# Altium schematic sheet JTAG&Trace.SchDoc
size A4; Revision: B.2
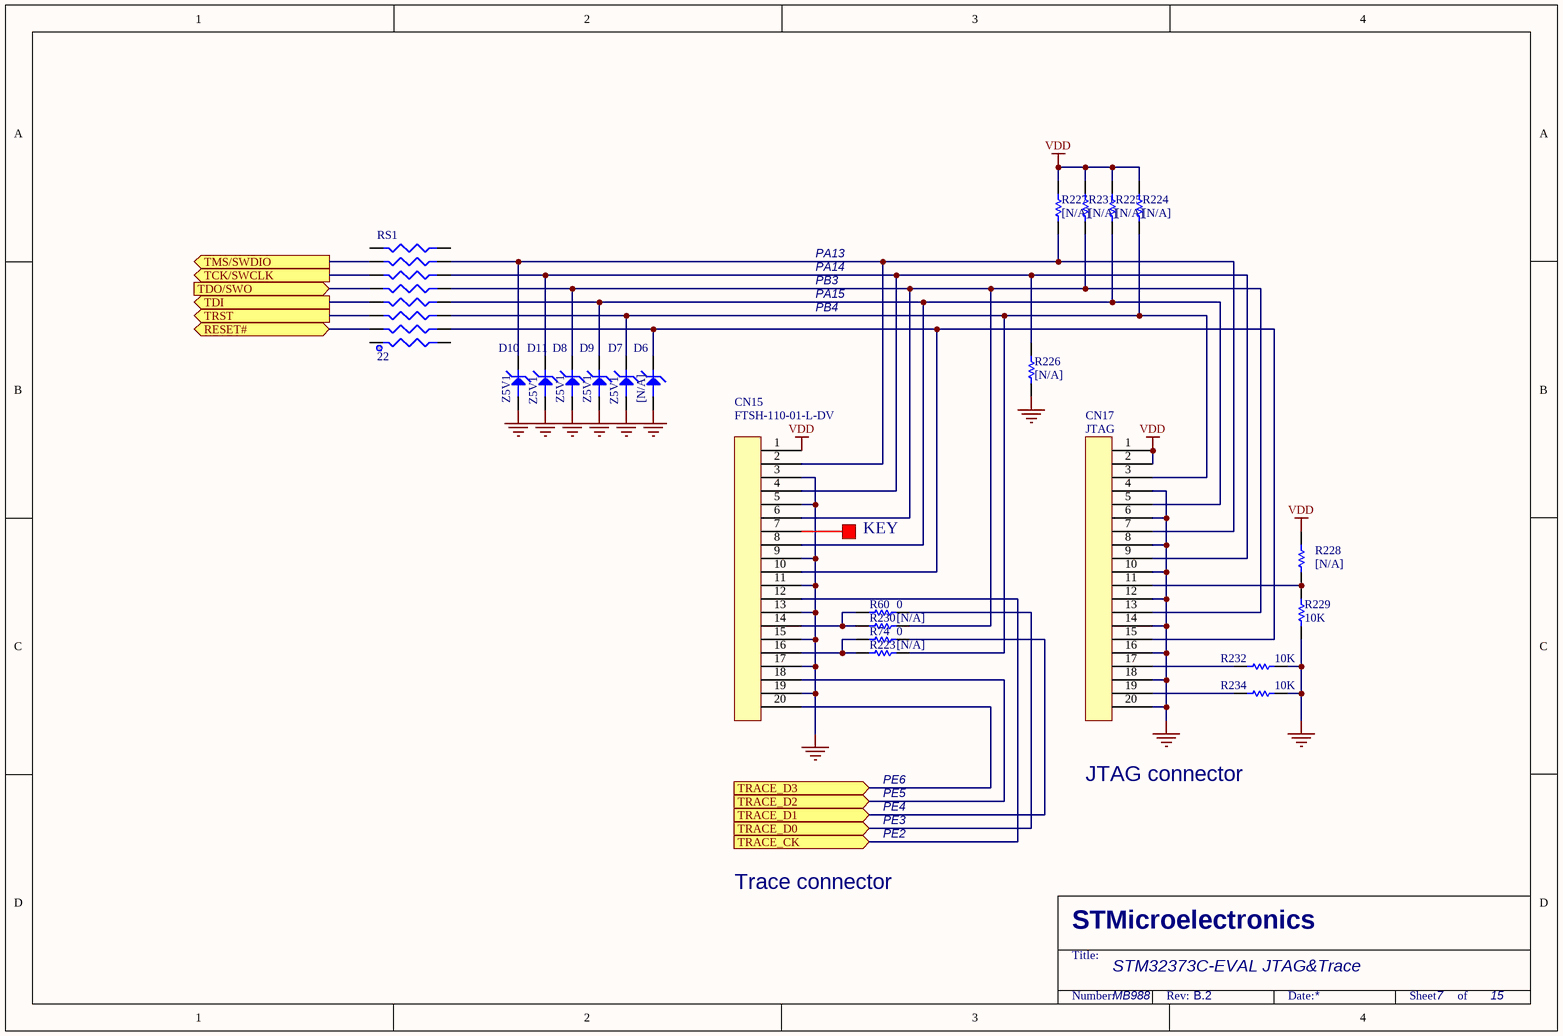
[diagram p0: JTAG&Trace.SchDoc]

## Parts
CN15  FTSH-110-01-L-DV  [FTSH-110-01-L-DV]
CN17  JTAG  [IDC20S]
D6  [N/A]  [SOT-23]
D7  Z5V1  [SOT-23]
D8  Z5V1  [SOT-23]
D9  Z5V1  [SOT-23]
D10  Z5V1  [SOT-23]
D11  Z5V1  [SOT-23]
R60  0  [0603R]
R74  0  [0603R]
R223  [N/A]  [0603R]
R224  [N/A]  [0603R]
R225  [N/A]  [0603R]
R226  [N/A]  [0603R]
R227  [N/A]  [0603R]
R228  [N/A]  [0603R]
R229  10K  [0603R]
R230  [N/A]  [0603R]
R231  [N/A]  [0603R]
R232  10K  [0603R]
R234  10K  [0603R]
RS1  22  [RES8B_0402]

## Ports
RESET# (bidir), TCK/SWCLK (out), TDI (out), TDO/SWO (in), TMS/SWDIO (out), TRACE_CK (in), TRACE_D0 (in), TRACE_D1 (in), TRACE_D2 (in), TRACE_D3 (in), TRST (out)

## Nets
GND: CN15.3 CN15.5 CN15.9 CN15.11 CN15.13 CN15.15 CN15.17 CN15.19 CN17.4 CN17.6 CN17.8 CN17.10 CN17.12 CN17.14 CN17.16 CN17.18 CN17.20 D6.2 D7.2 D8.2 D9.2 D10.2 D11.2 R226.1 R229.1 R232.1 R234.1
VDD: CN15.1 CN17.1 CN17.2 R224.2 R225.2 R227.2 R228.2 R231.2
RESET#: RS1.3 ; port RESET#
TCK/SWCLK: RS1.11 ; port TCK/SWCLK
TDI: RS1.7 ; port TDI
TDO/SWO: RS1.9 ; port TDO/SWO
TMS/SWDIO: RS1.13 ; port TMS/SWDIO
TRACE_CK: CN15.12 ; port TRACE_CK
TRACE_D0: R60.2 ; port TRACE_D0
TRACE_D1: R74.2 ; port TRACE_D1
TRACE_D2: CN15.18 ; port TRACE_D2
TRACE_D3: CN15.20 ; port TRACE_D3
TRST: RS1.5 ; port TRST
NetCN15_2: CN15.2 CN17.7 D10.3 R227.1 RS1.14
NetCN15_4: CN15.4 CN17.9 D11.3 R226.2 RS1.12
NetCN15_6: CN15.6 CN17.13 D8.3 R230.2 R231.1 RS1.10
NetCN15_8: CN15.8 CN17.5 D9.3 R225.1 RS1.8
NetCN15_10: CN15.10 CN17.15 D6.3 RS1.4
NetCN15_14: CN15.14 R60.1 R230.1
NetCN15_16: CN15.16 R74.1 R223.1
NetCN17_3: CN17.3 D7.3 R223.2 R224.1 RS1.6
NetCN17_11: CN17.11 R228.1 R229.2
NetCN17_17: CN17.17 R232.2
NetCN17_19: CN17.19 R234.2

Not connected (* = marked no-connect by the designer): CN15 7; RS1 1 2 15 16

## Notes on the sheet
- PA13
- PA14
- PB3
- PA15
- PB4
- KEY
- PE6
- JTAG connector
- PE5
- PE4
- PE3
- PE2
- Trace connector
- STM32373C-EVAL JTAG&Trace
- MB988
- 7
- 15
- STMicroelectronics
- Title:
- Number:
- Rev:
- Date:
- Sheet       of

## Library data of the parts
CN15 CN17 = 20PIN1
D6-D11 = BATS5V6
R60 R74 R223-R232 R234 = Res1: Resistor; Value: 1K; Published: 8-Jun-2000; Revision: July-2002: Re-released for DXP Platform.; Publisher: Altium Limited
RS1 = RES8B